# EAGLE design BPMLabLineSensor (EAGLE 7.5.0)
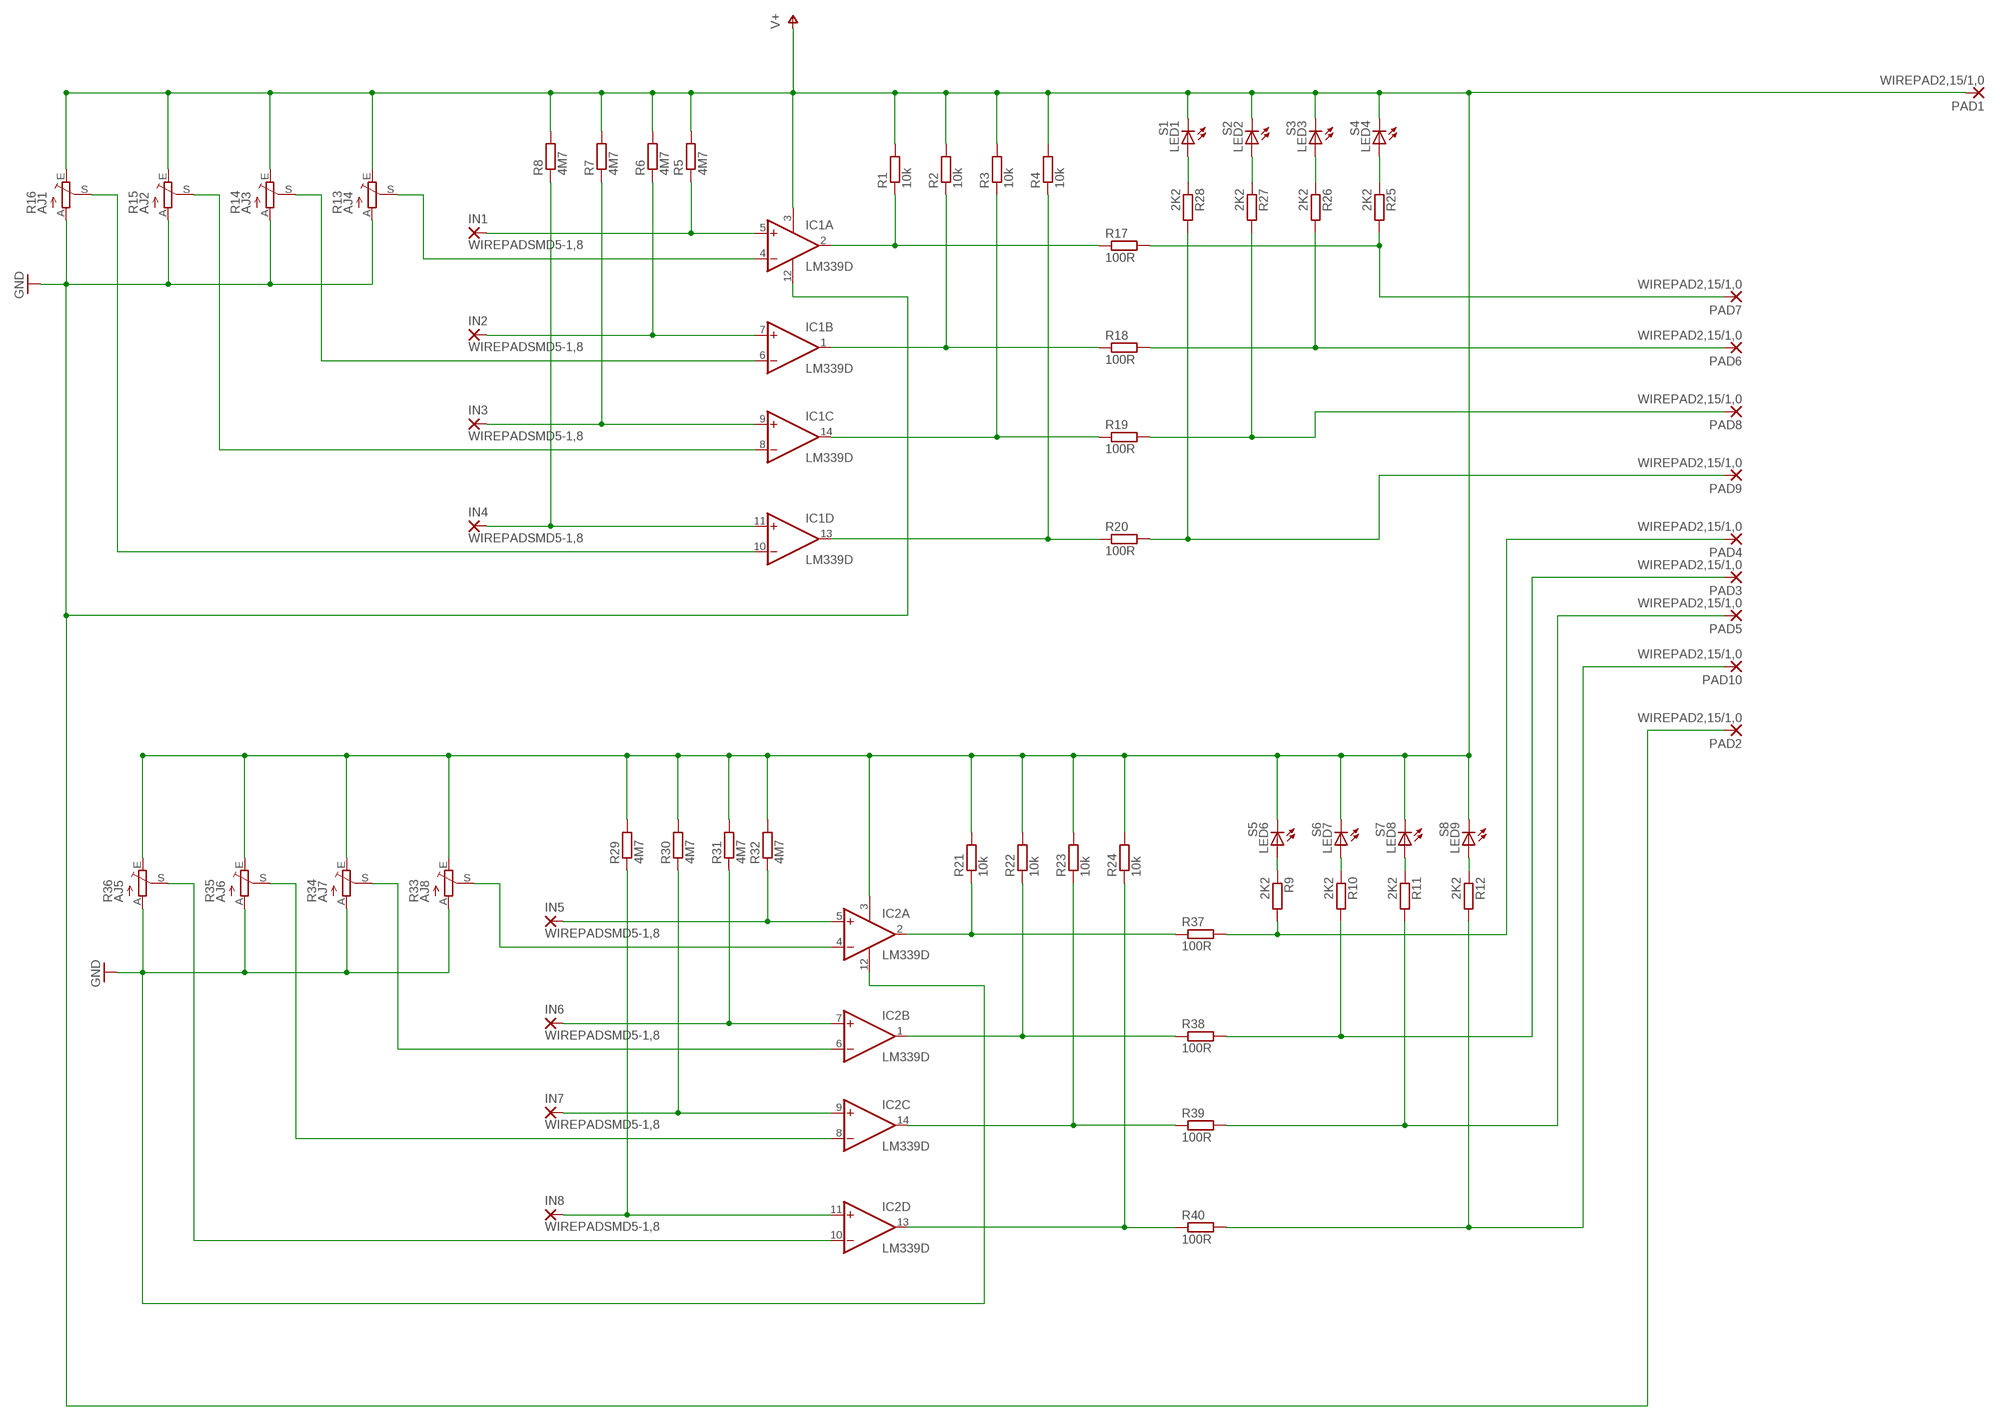
[diagram p0: schematic, sheet 1]

## Parts
IC1  LM339D  [SO14]
IC2  LM339D  [SO14]
IN1  WIREPADSMD5-1,8  [5-1,8]
IN2  WIREPADSMD5-1,8  [5-1,8]
IN3  WIREPADSMD5-1,8  [5-1,8]
IN4  WIREPADSMD5-1,8  [5-1,8]
IN5  WIREPADSMD5-1,8  [5-1,8]
IN6  WIREPADSMD5-1,8  [5-1,8]
IN7  WIREPADSMD5-1,8  [5-1,8]
IN8  WIREPADSMD5-1,8  [5-1,8]
LED1  S1  LED5MM  [LED5MM]
LED2  S2  LED5MM  [LED5MM]
LED3  S3  LED5MM  [LED5MM]
LED4  S4  LED5MM  [LED5MM]
LED6  S5  LED5MM  [LED5MM]
LED7  S6  LED5MM  [LED5MM]
LED8  S7  LED5MM  [LED5MM]
LED9  S8  LED5MM  [LED5MM]
PAD1  WIREPAD2,15/1,0  [2,15/1,0]
PAD2  WIREPAD2,15/1,0  [2,15/1,0]
PAD3  WIREPAD2,15/1,0  [2,15/1,0]
PAD4  WIREPAD2,15/1,0  [2,15/1,0]
PAD5  WIREPAD2,15/1,0  [2,15/1,0]
PAD6  WIREPAD2,15/1,0  [2,15/1,0]
PAD7  WIREPAD2,15/1,0  [2,15/1,0]
PAD8  WIREPAD2,15/1,0  [2,15/1,0]
PAD9  WIREPAD2,15/1,0  [2,15/1,0]
PAD10  WIREPAD2,15/1,0  [2,15/1,0]
R1  10k  R-EU_M0805  [M0805]
R2  10k  R-EU_M0805  [M0805]
R3  10k  R-EU_M0805  [M0805]
R4  10k  R-EU_M0805  [M0805]
R5  4M7  R-EU_M0805  [M0805]
R6  4M7  R-EU_M0805  [M0805]
R7  4M7  R-EU_M0805  [M0805]
R8  4M7  R-EU_M0805  [M0805]
R9  2K2  R-EU_M0805  [M0805]
R10  2K2  R-EU_M0805  [M0805]
R11  2K2  R-EU_M0805  [M0805]
R12  2K2  R-EU_M0805  [M0805]
R13  AJ4  TRIM_EU-RS3  [RS3]
R14  AJ3  TRIM_EU-RS3  [RS3]
R15  AJ2  TRIM_EU-RS3  [RS3]
R16  AJ1  TRIM_EU-RS3  [RS3]
R17  100R  R-EU_0204/7  [0204/7]
R18  100R  R-EU_0204/7  [0204/7]
R19  100R  R-EU_0204/7  [0204/7]
R20  100R  R-EU_0204/7  [0204/7]
R21  10k  R-EU_M0805  [M0805]
R22  10k  R-EU_M0805  [M0805]
R23  10k  R-EU_M0805  [M0805]
R24  10k  R-EU_M0805  [M0805]
R25  2K2  R-EU_M0805  [M0805]
R26  2K2  R-EU_M0805  [M0805]
R27  2K2  R-EU_M0805  [M0805]
R28  2K2  R-EU_M0805  [M0805]
R29  4M7  R-EU_M0805  [M0805]
R30  4M7  R-EU_M0805  [M0805]
R31  4M7  R-EU_M0805  [M0805]
R32  4M7  R-EU_M0805  [M0805]
R33  AJ8  TRIM_EU-RS3  [RS3]
R34  AJ7  TRIM_EU-RS3  [RS3]
R35  AJ6  TRIM_EU-RS3  [RS3]
R36  AJ5  TRIM_EU-RS3  [RS3]
R37  100R  R-EU_0204/7  [0204/7]
R38  100R  R-EU_0204/7  [0204/7]
R39  100R  R-EU_0204/7  [0204/7]
R40  100R  R-EU_0204/7  [0204/7]

## Nets
GND: IC1.12(P:GND) IC2.12(P:GND) PAD2.1(P) R13.A R14.A R15.A R16.A R33.A R34.A R35.A R36.A
N$1: IC1.2(A:OUT) R1.1 R17.1
N$2: IC1.1(B:OUT) R2.1 R18.1
N$3: IC1.14(C:OUT) R3.1 R19.1
N$4: IC1.13(D:OUT) R4.1 R20.1
N$5: IC1.5(A:+IN) IN1.1(P) R5.1
N$6: IC1.7(B:+IN) IN2.1(P) R6.1
N$7: IC1.9(C:+IN) IN3.1(P) R7.1
N$8: IC1.11(D:+IN) IN4.1(P) R8.1
N$10: IC1.10(D:-IN) R16.S
N$11: IC1.8(C:-IN) R15.S
N$12: IC1.4(A:-IN) R13.S
N$13: IC1.6(B:-IN) R14.S
N$15: PAD3.1(P) R10.2 R38.2
N$16: PAD4.1(P) R9.2 R37.2
N$17: LED6.A R9.1
N$18: LED7.A R10.1
N$19: LED8.A R11.1
N$20: LED9.A R12.1
N$22: PAD7.1(P) R17.2 R25.2
N$23: PAD9.1(P) R20.2 R28.2
N$24: PAD8.1(P) R19.2 R27.2
N$25: IC2.2(A:OUT) R21.1 R37.1
N$26: PAD6.1(P) R18.2 R26.2
N$27: IC2.1(B:OUT) R22.1 R38.1
N$28: LED1.A R28.1
N$29: LED2.A R27.1
N$30: LED3.A R26.1
N$31: LED4.A R25.1
N$32: IC2.14(C:OUT) R23.1 R39.1
N$33: IC2.13(D:OUT) R24.1 R40.1
N$34: IC2.10(D:-IN) R36.S
N$35: IC2.8(C:-IN) R35.S
N$36: IC2.4(A:-IN) R33.S
N$37: IC2.6(B:-IN) R34.S
N$38: IC2.5(A:+IN) IN5.1(P) R32.1
N$39: IC2.7(B:+IN) IN6.1(P) R31.1
N$40: IC2.9(C:+IN) IN7.1(P) R30.1
N$41: IC2.11(D:+IN) IN8.1(P) R29.1
N$42: PAD10.1(P) R12.2 R40.2
N$43: PAD5.1(P) R11.2 R39.2
V+: IC1.3(P:V+) IC2.3(P:V+) LED1.K(C) LED2.K(C) LED3.K(C) LED4.K(C) LED6.K(C) LED7.K(C) LED8.K(C) LED9.K(C) PAD1.1(P) R1.2 R2.2 R3.2 R4.2 R5.2 R6.2 R7.2 R8.2 R13.E R14.E R15.E R16.E R21.2 R22.2 R23.2 R24.2 R29.2 R30.2 R31.2 R32.2 R33.E R34.E R35.E R36.E

## Library data of the parts
IC1 IC2 = linear:LM339: Low Power Low Offset Voltage Quad Comparators with open collector; LM139/LM239/LM339/LM2901/LM3302
IN1-IN8 PAD1-PAD10 = wirepad:WIREPAD: Wire PAD connect wire on PCB
LED1-LED4 LED6-LED9 = led:LED: LED OSRAM: - CHIPLED LG R971, LG N971, LY N971, LG Q971, LY Q971, LO R971, LY R971 LH N974, LH R974 LS Q976, LO Q976, LY Q976 LO Q996 - Hyper CHIPLED LW Q18S LB Q993, LB Q99A, LB R99A - SideLED LS A670, LO A670, LY A670, LG A670, LP A670 LB A673, LV A673, LT A673, LW A673 LH A674 LY A675 LS A676, LA A676, LO A676, LY A676, LW A676 LS A679, LY A679, LG A679 - Hyper Micro SIDELED® LS Y876, LA Y876, LO Y876, LY Y876 LT Y87S - SmartLED LW L88C, LW L88S LB L89C, LB L89S, LG L890 LS L89K, LO L89K, LY L89K LS L896, LA L896, LO L896, LY L896 - TOPLED LS T670, LO T670, LY T670, LG T670, LP T670 LSG T670, LSP T670, LSY T670, LOP T670, LYG T670 LG T671, LOG T671, LSG T671 LB T673, LV T673, LT T673, LW T673 LH T674 LS T676, LA T676, LO T676, LY T676, LB T676, LH T676, LSB T676, LW T676 LB T67C, LV T67C, LT T67C, LS T67K, LO T67K, LY T67K, LW E67C LS E67B, LA E67B, LO E67B, LY E67B, LB E67C, LV E67C, LT E67C LW T67C LS T679, LY T679, LG T679 LS T770, LO T770, LY T770, LG T770, LP T770 LB T773, LV T773, LT T773, LW T773 LH T774 LS E675, LA E675, LY E675, LS T675 LS T776, LA T776, LO T776, LY T776, LB T776 LHGB T686 LT T68C, LB T68C - Hyper Mini TOPLED® LB M676 - Mini TOPLED Santana® LG M470 LS M47K, LO M47K, LY M47K Source: http://www.osram.convergy.de LUXEON: - LUMILED® LXK2-PW12-R00, LXK2-PW12-S00, LXK2-PW14-U00, LXK2-PW14-V00 LXK2-PM12-R00, LXK2-PM12-S00, LXK2-PM14-U00 LXK2-PE12-Q00, LXK2-PE12-R00, LXK2-PE12-S00, LXK2-PE14-T00, LXK2-PE14-U00 LXK2-PB12-K00, LXK2-PB12-L00, LXK2-PB12-M00, LXK2-PB14-N00, LXK2-PB14-P00, LXK2-PB14-Q00 LXK2-PR12-L00, LXK2-PR12-M00, LXK2-PR14-Q00, LXK2-PR14-R00 LXK2-PD12-Q00, LXK2-PD12-R00, LXK2-PD12-S00 LXK2-PH12-R00, LXK2-PH12-S00 LXK2-PL12-P00, LXK2-PL12-Q00, LXK2-PL12-R00 Source: www.luxeon.com KINGBRIGHT: KA-3528ASYC Source: www.kingbright.com
R1-R12 R17-R32 R37-R40 = resistor:R-EU_: RESISTOR, European symbol
R13-R16 R33-R36 = pot:TRIM_EU-: POTENTIOMETER

## Board
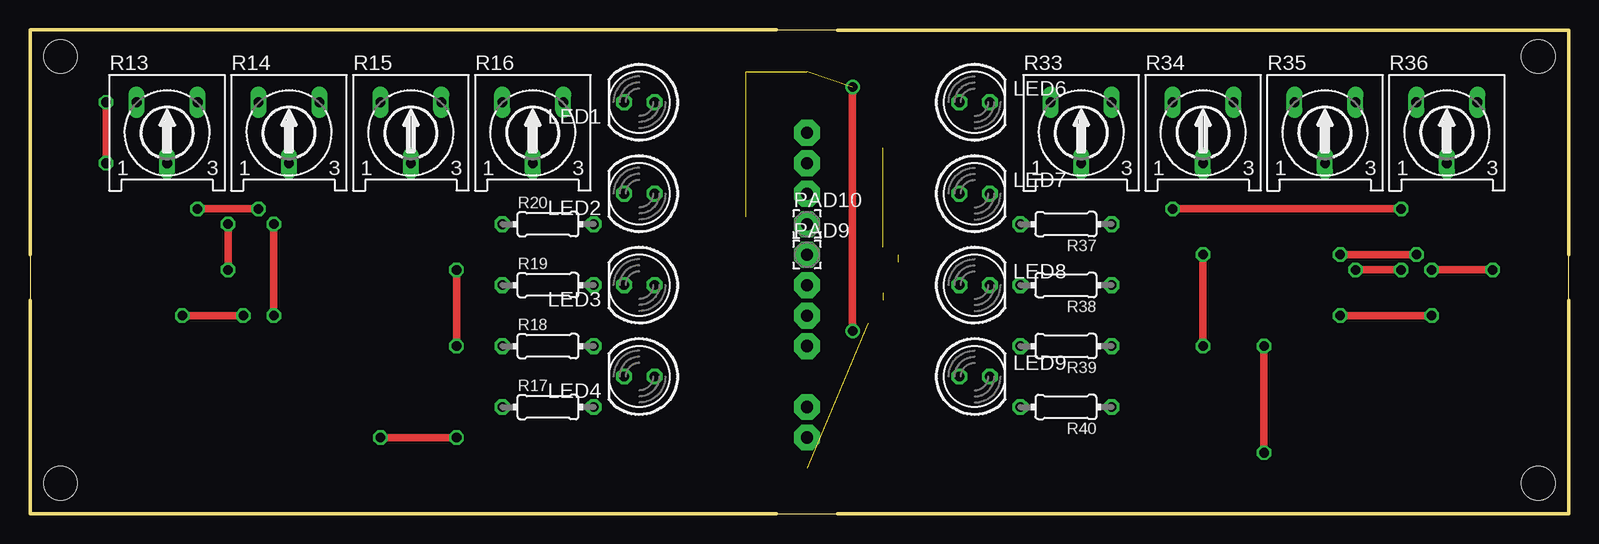
[diagram p1: board, top side]
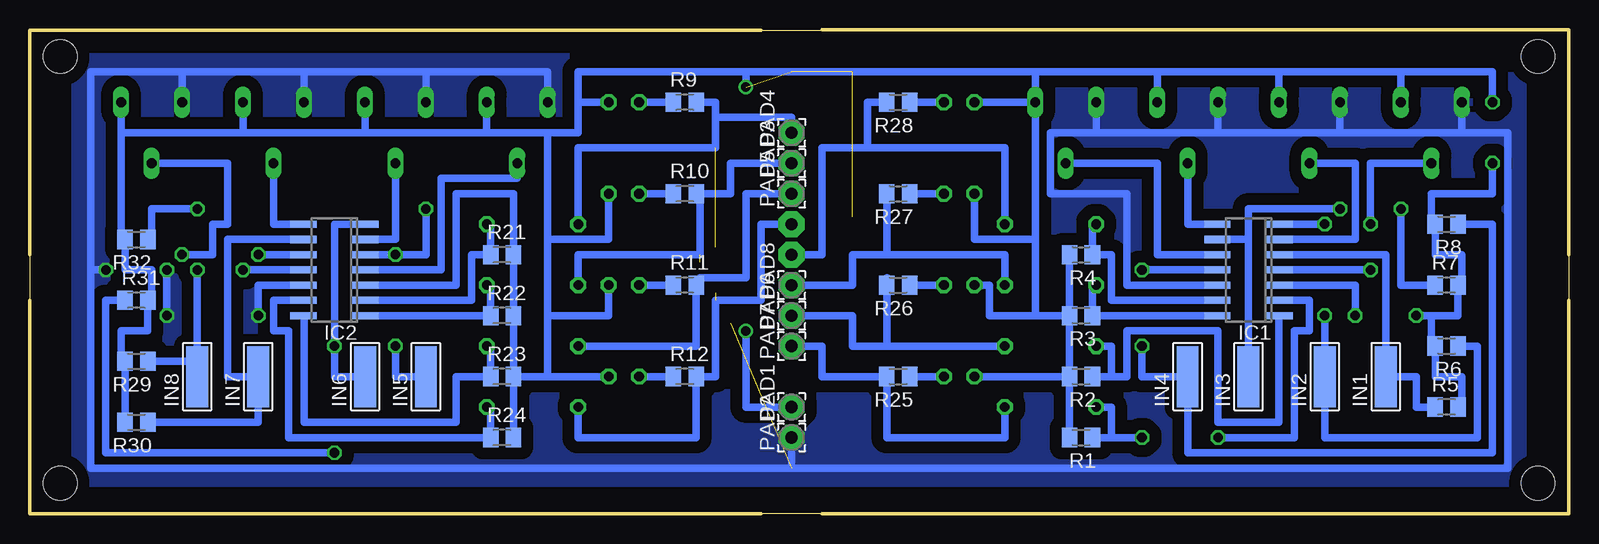
[diagram p2: board, bottom side, seen from below]

Size 128.25 x 40.31 mm. Coordinates in mm from the lower left corner, seen from the top.
Outline: 0,0 128.25,0 128.25,40.31 0,40.31 0,0
Copper layers (1*16): Top 0.035mm / dielectric 1.5mm / Bottom 0.035mm
Design rules "default *": minimum track width 10mil, minimum drill 24mil, track to track 8mil, track to pad 8mil, pad to pad 8mil, via to via 8mil, smd to smd 8mil, copper to edge 40mil, drill to drill 8mil, minimum pad ring 10mil, minimum via ring 8mil, stop-mask expansion 4mil, vias tented up to drill 0mil, thermal gap 0mil
Holes 2.8 mm at 2.54,38.1 125.73,2.54 2.54,2.54 125.73,38.1
Milling: 8 lines

### Footprints (pad centres in the part's own frame; a part is rotated, then mirrored left to right if it is on the bottom)
SO14 = smd 0.6 x 2.2: 1 -3.81,-2.6; 2 -2.54,-2.6; 3 -1.27,-2.6; 4 0,-2.6; 5 1.27,-2.6; 6 2.54,-2.6; 7 3.81,-2.6; 8 3.81,2.6; 9 2.54,2.6; 10 1.27,2.6; 11 0,2.6; 12 -1.27,2.6; 13 -2.54,2.6; 14 -3.81,2.6
5-1,8 = smd 1.829 x 5.08: 1 0,0
LED5MM = drill 0.813 octagon: A -1.27,0; K 1.27,0
2,15/1,0 = drill 1.016 pad 2.159 octagon: 1 0,0
M0805 = smd 1.3 x 1.6: 1 -0.95,0; 2 0.95,0
RS3 = drill 0.813 long: A -2.54,2.54; E 2.54,2.54; S 0,-2.54
0204/7 = drill 0.813 octagon: 1 -3.81,0; 2 3.81,0

### Placement (x,y rotation side)
IC1  26.67,20.32 90 bottom
IC2  102.87,20.32 90 bottom
IN1  15.24,11.43 0 bottom
IN2  20.32,11.43 0 bottom
IN3  26.67,11.43 0 bottom
IN4  31.75,11.43 0 bottom
IN5  95.25,11.43 0 bottom
IN6  100.33,11.43 0 bottom
IN7  109.22,11.43 0 bottom
IN8  114.3,11.43 0 bottom
LED1  50.8,34.29 180 top
LED2  50.8,26.67 180 top
LED3  50.8,19.05 180 top
LED4  50.8,11.43 180 top
LED6  78.74,34.29 0 top
LED7  78.74,26.67 0 top
LED8  78.74,19.05 0 top
LED9  78.74,11.43 0 top
PAD1  64.77,8.89 90 bottom
PAD2  64.77,6.35 90 bottom
PAD3  64.77,29.21 90 bottom
PAD4  64.77,31.75 90 bottom
PAD5  64.77,26.67 90 bottom
PAD6  64.77,16.51 90 bottom
PAD7  64.77,13.97 90 bottom
PAD8  64.77,19.05 90 bottom
PAD9  64.77,21.59 0 top
PAD10  64.77,24.13 0 top
R1  40.64,6.35 180 bottom
R2  40.64,11.43 180 bottom
R3  40.64,16.51 180 bottom
R4  40.64,21.59 180 bottom
R5  10.16,8.89 0 bottom
R6  10.16,13.97 180 bottom
R7  10.16,19.05 0 bottom
R8  10.16,24.13 180 bottom
R9  73.66,34.29 0 bottom
R10  73.66,26.67 0 bottom
R11  73.66,19.05 0 bottom
R12  73.66,11.43 0 bottom
R13  11.43,31.75 0 top
R14  21.59,31.75 0 top
R15  31.75,31.75 0 top
R16  41.91,31.75 0 top
R17  43.18,8.89 0 top
R18  43.18,13.97 0 top
R19  43.18,19.05 0 top
R20  43.18,24.13 0 top
R21  88.9,21.59 0 bottom
R22  88.9,16.51 0 bottom
R23  88.9,11.43 0 bottom
R24  88.9,6.35 0 bottom
R25  55.88,11.43 180 bottom
R26  55.88,19.05 180 bottom
R27  55.88,26.67 180 bottom
R28  55.88,34.29 180 bottom
R29  119.38,12.7 180 bottom
R30  119.38,7.62 180 bottom
R31  119.38,17.78 0 bottom
R32  119.38,22.86 180 bottom
R33  87.63,31.75 0 top
R34  97.79,31.75 0 top
R35  107.95,31.75 0 top
R36  118.11,31.75 0 top
R37  86.36,24.13 180 top
R38  86.36,19.05 180 top
R39  86.36,13.97 180 top
R40  86.36,8.89 180 top

### Tracks (layer width: path | path; a pad name or v marks a point on that pad's centre or on a via)
GND  (via drill 0.8)  (1 unrouted)
  Top 0.61: v109.22,16.51 v116.84,16.51 | v116.84,20.32 v121.92,20.32
  Bottom 0.61: R14.A 19.05,31.75 | 19.05,31.75 8.89,31.75 | 8.89,31.75 R13.A | 29.21,31.75 19.05,31.75 | R15.A 29.21,31.75 | 29.21,31.75 39.37,31.75 | 39.37,31.75 R16.A | IC1.12 36.83,19.05 36.83,26.67 43.18,26.67 43.18,31.75 39.37,31.75 | R33.A 85.09,36.83 95.25,36.83 | R34.A 95.25,36.83 | 95.25,36.83 105.41,36.83 | 105.41,36.83 R35.A | R36.A 115.57,36.83 | 115.57,36.83 105.41,36.83 | IC2.12 109.22,19.05 v109.22,16.51 | v116.84,16.51 v116.84,20.32 | 123.19,20.32 123.19,36.83 115.57,36.83 | 123.19,20.32 123.19,3.81 69.85,3.81 64.77,3.81 | 123.19,20.32 v121.92,20.32 | 64.77,3.81 5.08,3.81 5.08,31.75 8.89,31.75 | PAD2.1 64.77,3.81
  pour Bottom (isolate 1.016): 3.81,38.1 124.46,38.1 124.46,2.54 3.81,2.54
N$1  (via drill 0.8)
  Top 0.61: v29.21,6.35 v35.56,6.35
  Bottom 0.61: IC1.2 21.59,17.78 21.59,15.24 22.86,15.24 22.86,6.35 v29.21,6.35 | v35.56,6.35 38.1,6.35 | 38.1,6.35 R1.1 | R17.1 38.1,8.89 38.1,6.35
N$2
  Bottom 0.61: IC1.1 24.13,16.51 24.13,7.62 29.21,7.62 29.21,15.24 36.83,15.24 36.83,11.43 38.1,11.43 | 38.1,11.43 R2.1 | R18.1 38.1,13.97 38.1,11.43
N$3
  Bottom 0.61: IC1.14 R3.1 39.69,19.05 R19.1
N$4
  Bottom 0.61: IC1.13 38.1,17.78 38.1,21.59 R4.1 39.69,24.13 R20.1
N$5
  Bottom 0.61: R5.1 12.7,8.89 12.7,11.43 IN1.1 15.24,21.59 IC1.5
N$6  (via drill 0.8)
  Top 0.61: v20.32,16.51 v20.32,24.13
  Bottom 0.61: R6.1 7.62,13.97 7.62,6.35 20.32,6.35 IN2.1 v20.32,16.51 | v20.32,24.13 IC1.7
N$7  (via drill 0.8)
  Top 0.61: v19.05,25.4 v13.97,25.4
  Bottom 0.61: IN3.1 26.67,22.86 | IC1.9 26.67,22.86 | 26.67,22.86 26.67,25.4 v19.05,25.4 | v13.97,25.4 13.97,19.05 R7.1
N$8  (via drill 0.8)
  Top 0.61: v35.56,13.97 v35.56,20.32
  Bottom 0.61: R8.1 6.35,24.13 6.35,5.08 31.75,5.08 IN4.1 35.56,11.43 v35.56,13.97 | v35.56,20.32 IC1.11
N$10
  Bottom 0.61: IC1.10 34.29,21.59 34.29,29.21 R16.S
N$11
  Bottom 0.61: IC1.8 31.75,24.13 R15.S
N$12  (via drill 0.8)
  Top 0.61: v16.51,20.32 v16.51,24.13
  Bottom 0.61: IC1.4 v16.51,20.32 | v16.51,24.13 16.51,29.21 R13.S
N$13
  Bottom 0.61: IC1.6 17.78,22.86 17.78,29.21 R14.S
N$15  (1 unrouted)
  Bottom 0.61: 72.39,26.67 72.39,21.59 82.55,21.59 R38.2 | 72.39,26.67 R10.2 | 72.39,26.67 69.85,26.67 69.85,29.21 PAD3.1
N$16  (1 unrouted)
  Bottom 0.61: 71.12,33.02 71.12,30.48 82.55,30.48 R37.2 | R9.2 71.12,34.29 71.12,33.02 | 71.12,33.02 64.77,33.02 PAD4.1
N$17
  Bottom 0.61: R9.1 LED6.A
N$18
  Bottom 0.61: R10.1 LED7.A
N$19
  Bottom 0.61: R11.1 LED8.A
N$20
  Bottom 0.61: R12.1 LED9.A
N$22
  Bottom 0.61: R17.2 46.99,6.35 56.83,6.35 R25.2 62.23,11.43 62.23,13.97 PAD7.1
N$23
  Bottom 0.61: 58.42,30.48 58.42,34.29 R28.2 | R20.2 46.99,30.48 58.42,30.48 | PAD9.1 62.23,21.59 62.23,30.48 58.42,30.48
N$24
  Bottom 0.61: R19.2 46.99,21.59 56.83,21.59 | 56.83,21.59 R27.2 | 56.83,21.59 59.69,21.59 59.69,19.05 PAD8.1
N$25
  Bottom 0.61: R37.1 89.85,24.13 R21.1 91.44,21.59 91.44,17.78 IC2.2
N$26
  Bottom 0.61: R18.2 56.83,13.97 | 56.83,13.97 R26.2 56.83,19.68 | 56.83,13.97 59.69,13.97 59.69,16.51 PAD6.1
N$27
  Bottom 0.61: R38.1 89.85,19.05 R22.1 IC2.1
N$28
  Bottom 0.61: LED1.A R28.1
N$29
  Bottom 0.61: LED2.A R27.1
N$30
  Bottom 0.61: LED3.A R26.1
N$31
  Bottom 0.61: LED4.A R25.1
N$32
  Bottom 0.61: R39.1 89.85,13.97 R23.1 92.71,11.43 92.71,7.62 105.41,7.62 105.41,16.51 IC2.14
N$33
  Bottom 0.61: R40.1 89.85,8.89 R24.1 106.68,6.35 106.68,15.24 107.95,15.24 107.95,17.78 IC2.13
N$34  (via drill 0.8)
  Top 0.61: v115.57,21.59 v109.22,21.59
  Bottom 0.61: R36.S 111.76,29.21 111.76,24.13 113.03,24.13 113.03,21.59 v115.57,21.59 | v109.22,21.59 IC2.10
N$35
  Bottom 0.61: IC2.8 107.95,24.13 R35.S
N$36
  Bottom 0.61: IC2.4 93.98,20.32 93.98,27.94 87.63,27.94 R33.S
N$37
  Bottom 0.61: R34.S 97.79,22.86 IC2.6
N$38  (via drill 0.8)
  Top 0.61: v97.79,13.97 v97.79,21.59 | v114.3,25.4 v95.25,25.4
  Bottom 0.61: IN5.1 97.79,11.43 v97.79,13.97 | IC2.5 v97.79,21.59 95.25,21.59 v95.25,25.4 | R32.1 118.11,22.86 118.11,25.4 v114.3,25.4
N$39  (via drill 0.8)
  Top 0.61: v102.87,5.08 v102.87,13.97
  Bottom 0.61: R31.1 121.92,17.78 121.92,5.08 v102.87,5.08 | IN6.1 102.87,11.43 v102.87,13.97 102.87,24.13 IC2.7
N$40
  Bottom 0.61: IC2.9 111.76,22.86 111.76,11.43 IN7.1 109.22,7.62 R30.1
N$41  (via drill 0.8)
  Top 0.61: v110.49,20.32 v114.3,20.32
  Bottom 0.61: IN8.1 114.3,12.7 | 114.3,12.7 R29.1 | IC2.11 v110.49,20.32 | v114.3,20.32 114.3,12.7
N$42  (1 unrouted)
  Bottom 0.61: R40.2 82.55,6.35 72.71,6.35 R12.2 71.12,11.43 71.12,17.78 67.31,17.78 67.31,24.13 PAD10.1
N$43
  Bottom 0.61: R39.2 72.71,13.97 R11.2 72.39,19.05 72.39,19.68 68.58,19.68 68.58,26.67 PAD5.1
V+  (via drill 0.8)  (3 unrouted)
  Top 0.61: v17.78,16.51 v12.7,16.51 | v6.35,29.21 v6.35,34.29 | v68.58,15.24 v68.58,35.56
  Bottom 0.61: 11.43,16.51 11.43,13.97 R6.2 11.11,11.43 8.89,11.43 8.89,8.89 R5.2 | 11.43,16.51 9.21,16.51 R7.2 8.89,19.05 8.89,21.59 11.11,21.59 R8.2 11.43,24.13 11.43,26.67 6.35,26.67 v6.35,29.21 | IC1.3 17.78,19.05 v17.78,16.51 | v12.7,16.51 11.43,16.51 | R3.2 R2.2 | R2.2 R1.2 | R3.2 R4.2 | 44.45,16.51 R3.2 | LED4.K R2.2 | 82.55,34.29 82.55,31.75 85.09,31.75 | 85.09,31.75 85.09,22.86 | 85.09,22.86 85.09,16.51 | 85.09,16.51 80.01,16.51 LED8.K | LED7.K 80.01,22.86 85.09,22.86 | LED9.K 85.09,11.43 | 85.09,11.43 85.09,16.51 | LED1.K R16.E | R16.E 44.45,22.86 | 44.45,22.86 49.53,22.86 LED2.K | LED3.K 48.26,19.05 48.26,16.51 44.45,16.51 | 44.45,16.51 44.45,22.86 | R24.2 R23.2 | R23.2 R22.2 R21.2 87.95,26.67 92.71,26.67 92.71,19.05 IC2.3 | 85.09,31.75 90.17,31.75 | 90.17,31.75 R33.E | 110.49,31.75 120.65,31.75 R36.E 120.65,22.86 R32.2 120.33,20.32 118.11,20.32 118.11,17.78 R31.2 118.43,15.24 120.65,15.24 120.65,12.7 R29.2 R30.2 | R35.E 110.49,31.75 | 110.49,31.75 100.33,31.75 | R34.E 100.33,31.75 | 100.33,31.75 90.17,31.75 | v6.35,34.29 6.35,36.83 13.97,36.83 | R13.E 13.97,36.83 | 13.97,36.83 24.13,36.83 | R14.E 24.13,36.83 | 24.13,36.83 34.29,36.83 | R15.E 34.29,36.83 | 34.29,36.83 44.45,36.83 | 44.45,36.83 R16.E | 68.58,36.83 44.45,36.83 | v68.58,35.56 68.58,36.83 | 68.58,36.83 82.55,36.83 82.55,34.29 | 82.55,34.29 LED6.K | PAD1.1 68.58,8.89 v68.58,15.24 | 85.09,11.43 R23.2